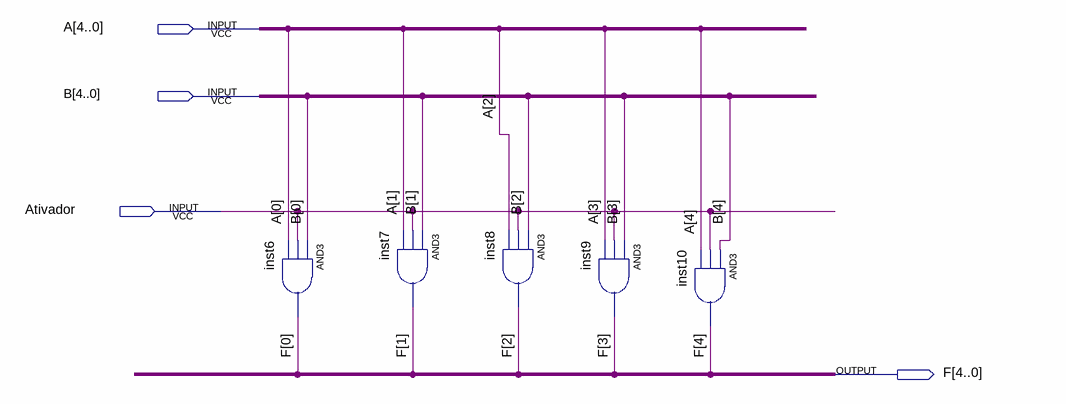
[diagram p0: schematic sheet]
// Quartus schematic AandB.bdf as structural Verilog: 5 symbols, 4 pins
module AandB (
  input  [4:0] A,
  input  [4:0] B,
  input  Ativador,
  output [4:0] F
);

  and inst6 (F[0], B[0], Ativador, A[0]);
  and inst7 (F[1], B[1], Ativador, A[1]);
  and inst8 (F[2], B[2], Ativador, A[2]);
  and inst9 (F[3], B[3], Ativador, A[3]);
  and inst10 (F[4], B[4], Ativador, A[4]);
endmodule
